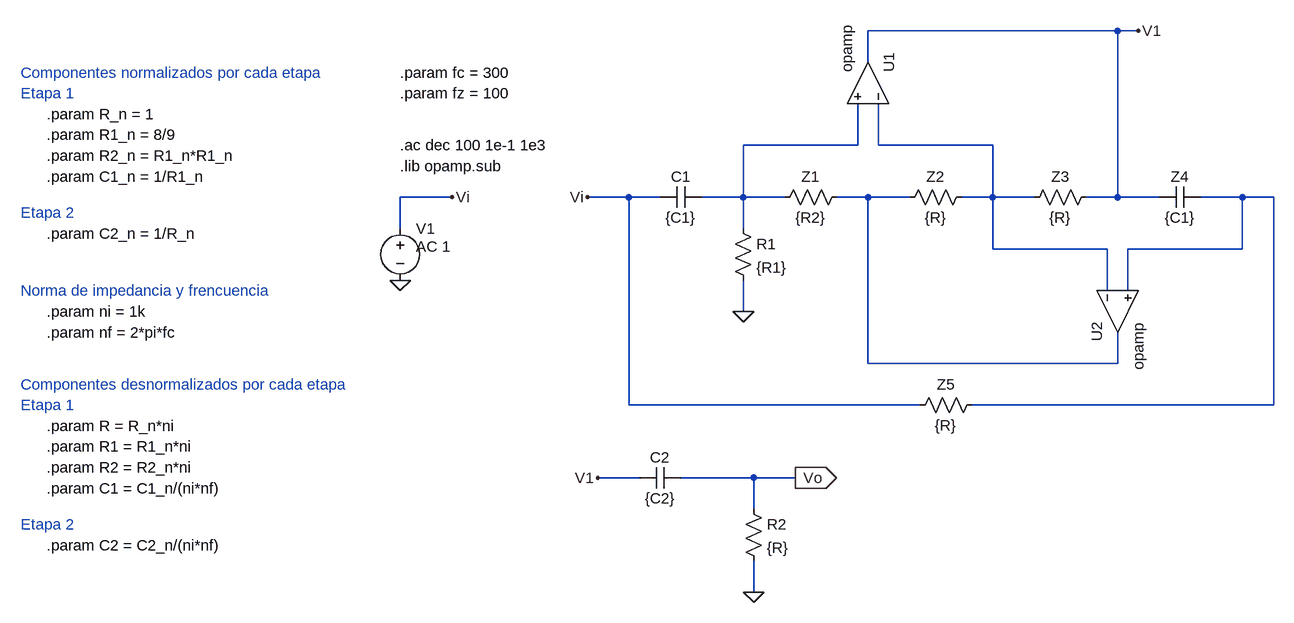
[diagram p0: schematic TPS5.asc]
TPS5.asc, the LTspice schematic file:
Version 4
SHEET 1 880 964
WIRE 64 -480 -320 -480
WIRE 96 -480 64 -480
WIRE -320 -432 -320 -480
WIRE -336 -304 -336 -368
WIRE -336 -304 -512 -304
WIRE -304 -304 -304 -368
WIRE -128 -304 -304 -304
WIRE -960 -224 -1040 -224
WIRE -688 -224 -752 -224
WIRE -640 -224 -688 -224
WIRE -512 -224 -512 -304
WIRE -512 -224 -576 -224
WIRE -448 -224 -512 -224
WIRE -320 -224 -368 -224
WIRE -256 -224 -320 -224
WIRE -128 -224 -128 -304
WIRE -128 -224 -176 -224
WIRE -64 -224 -128 -224
WIRE 64 -224 64 -480
WIRE 64 -224 16 -224
WIRE 128 -224 64 -224
WIRE 256 -224 192 -224
WIRE 304 -224 256 -224
WIRE -1040 -176 -1040 -224
WIRE -512 -176 -512 -224
WIRE -128 -144 -128 -224
WIRE 48 -144 -128 -144
WIRE 256 -144 256 -224
WIRE 256 -144 80 -144
WIRE 48 -80 48 -144
WIRE 80 -80 80 -144
WIRE -512 -48 -512 -96
WIRE -320 32 -320 -224
WIRE 64 32 64 -16
WIRE 64 32 -320 32
WIRE -688 96 -688 -224
WIRE -240 96 -688 96
WIRE 304 96 304 -224
WIRE 304 96 -160 96
WIRE -672 208 -736 208
WIRE -496 208 -608 208
WIRE -432 208 -496 208
WIRE -496 256 -496 208
WIRE -496 384 -496 336
FLAG -752 -224 Vi
FLAG 96 -480 V1
FLAG -1040 -96 0
FLAG -960 -224 Vi
FLAG -512 -48 0
FLAG -496 384 0
FLAG -736 208 V1
FLAG -432 208 Vo
IOPIN -432 208 Out
SYMBOL voltage -1040 -192 R0
WINDOW 123 24 44 Left 2
WINDOW 39 0 0 Left 2
SYMATTR Value2 AC 1
SYMATTR InstName V1
SYMATTR Value ""
SYMBOL res -352 -240 R90
WINDOW 0 0 56 VBottom 2
WINDOW 3 32 56 VTop 2
SYMATTR InstName Z1
SYMATTR Value {R2}
SYMBOL res 32 -240 R90
WINDOW 0 0 56 VBottom 2
WINDOW 3 32 56 VTop 2
SYMATTR InstName Z3
SYMATTR Value {R}
SYMBOL res -256 112 R270
WINDOW 0 32 56 VTop 2
WINDOW 3 0 56 VBottom 2
SYMATTR InstName Z5
SYMATTR Value {R}
SYMBOL Opamps\\opamp -256 -400 M270
SYMATTR InstName U1
SYMBOL Opamps\\opamp 0 -48 M90
SYMATTR InstName U2
SYMBOL res -160 -240 R90
WINDOW 0 0 56 VBottom 2
WINDOW 3 32 56 VTop 2
SYMATTR InstName Z2
SYMATTR Value {R}
SYMBOL cap 192 -240 R90
WINDOW 0 0 32 VBottom 2
WINDOW 3 32 32 VTop 2
SYMATTR InstName Z4
SYMATTR Value {C1}
SYMBOL res -528 -192 R0
SYMATTR InstName R1
SYMATTR Value {R1}
SYMBOL cap -576 -240 R90
WINDOW 0 0 32 VBottom 2
WINDOW 3 32 32 VTop 2
SYMATTR InstName C1
SYMATTR Value {C1}
SYMBOL cap -608 192 R90
WINDOW 0 0 32 VBottom 2
WINDOW 3 32 32 VTop 2
SYMATTR InstName C2
SYMATTR Value {C2}
SYMBOL res -512 240 R0
SYMATTR InstName R2
SYMATTR Value {R}
TEXT -1040 -304 Left 2 !.ac dec 100 1e-1 1e3
TEXT -1040 -272 Left 2 !.lib opamp.sub
TEXT -1040 -416 Left 2 !.param fc = 300
TEXT -1584 -352 Left 2 !.param R_n = 1
TEXT -1584 -320 Left 2 !.param R1_n = 8/9
TEXT -1040 -384 Left 2 !.param fz = 100
TEXT -1584 -256 Left 2 !.param C1_n = 1/R1_n
TEXT -1584 -168 Left 2 !.param C2_n = 1/R_n
TEXT -1584 -48 Left 2 !.param ni = 1k
TEXT -1584 -16 Left 2 !.param nf = 2*pi*fc
TEXT -1584 128 Left 2 !.param R = R_n*ni
TEXT -1584 160 Left 2 !.param R1 = R1_n*ni
TEXT -1584 192 Left 2 !.param R2 = R2_n*ni
TEXT -1584 312 Left 2 !.param C2 = C2_n/(ni*nf)
TEXT -1584 224 Left 2 !.param C1 = C1_n/(ni*nf)
TEXT -1584 -288 Left 2 !.param R2_n = R1_n*R1_n
TEXT -1624 -416 Left 2 ;Componentes normalizados por cada etapa
TEXT -1624 -384 Left 2 ;Etapa 1
TEXT -1624 -200 Left 2 ;Etapa 2
TEXT -1624 -80 Left 2 ;Norma de impedancia y frencuencia
TEXT -1624 64 Left 2 ;Componentes desnormalizados por cada etapa
TEXT -1624 96 Left 2 ;Etapa 1
TEXT -1624 280 Left 2 ;Etapa 2

The netlist it stands for:
* TPS5.asc
V1 Vi 0 AC 1
R§Z1 N003 N001 {R2}
R§Z3 V1 N002 {R}
R§Z5 Vi N004 {R}
XU1 N002 N001 V1 opamp Aol=100K GBW=10Meg  ; pins invin noninvin out
XU2 N002 N004 N003 opamp Aol=100K GBW=10Meg  ; pins invin noninvin out
R§Z2 N002 N003 {R}
C§Z4 N004 V1 {C1}
R1 N001 0 {R1}
C1 N001 Vi {C1}
C2 Vo V1 {C2}
R2 Vo 0 {R}
.ac dec 100 1e-1 1e3
.lib opamp.sub
.param fc = 300
.param R_n = 1
.param R1_n = 8/9
.param fz = 100
.param C1_n = 1/R1_n
.param C2_n = 1/R_n
.param ni = 1k
.param nf = 2*pi*fc
.param R = R_n*ni
.param R1 = R1_n*ni
.param R2 = R2_n*ni
.param C2 = C2_n/(ni*nf)
.param C1 = C1_n/(ni*nf)
.param R2_n = R1_n*R1_n
* Componentes normalizados por cada etapa
* Etapa 1
* Etapa 2
* Norma de impedancia y frencuencia
* Componentes desnormalizados por cada etapa
* Etapa 1
* Etapa 2
.backanno
.end